# EAGLE design powermeter (EAGLE 6.6.0)
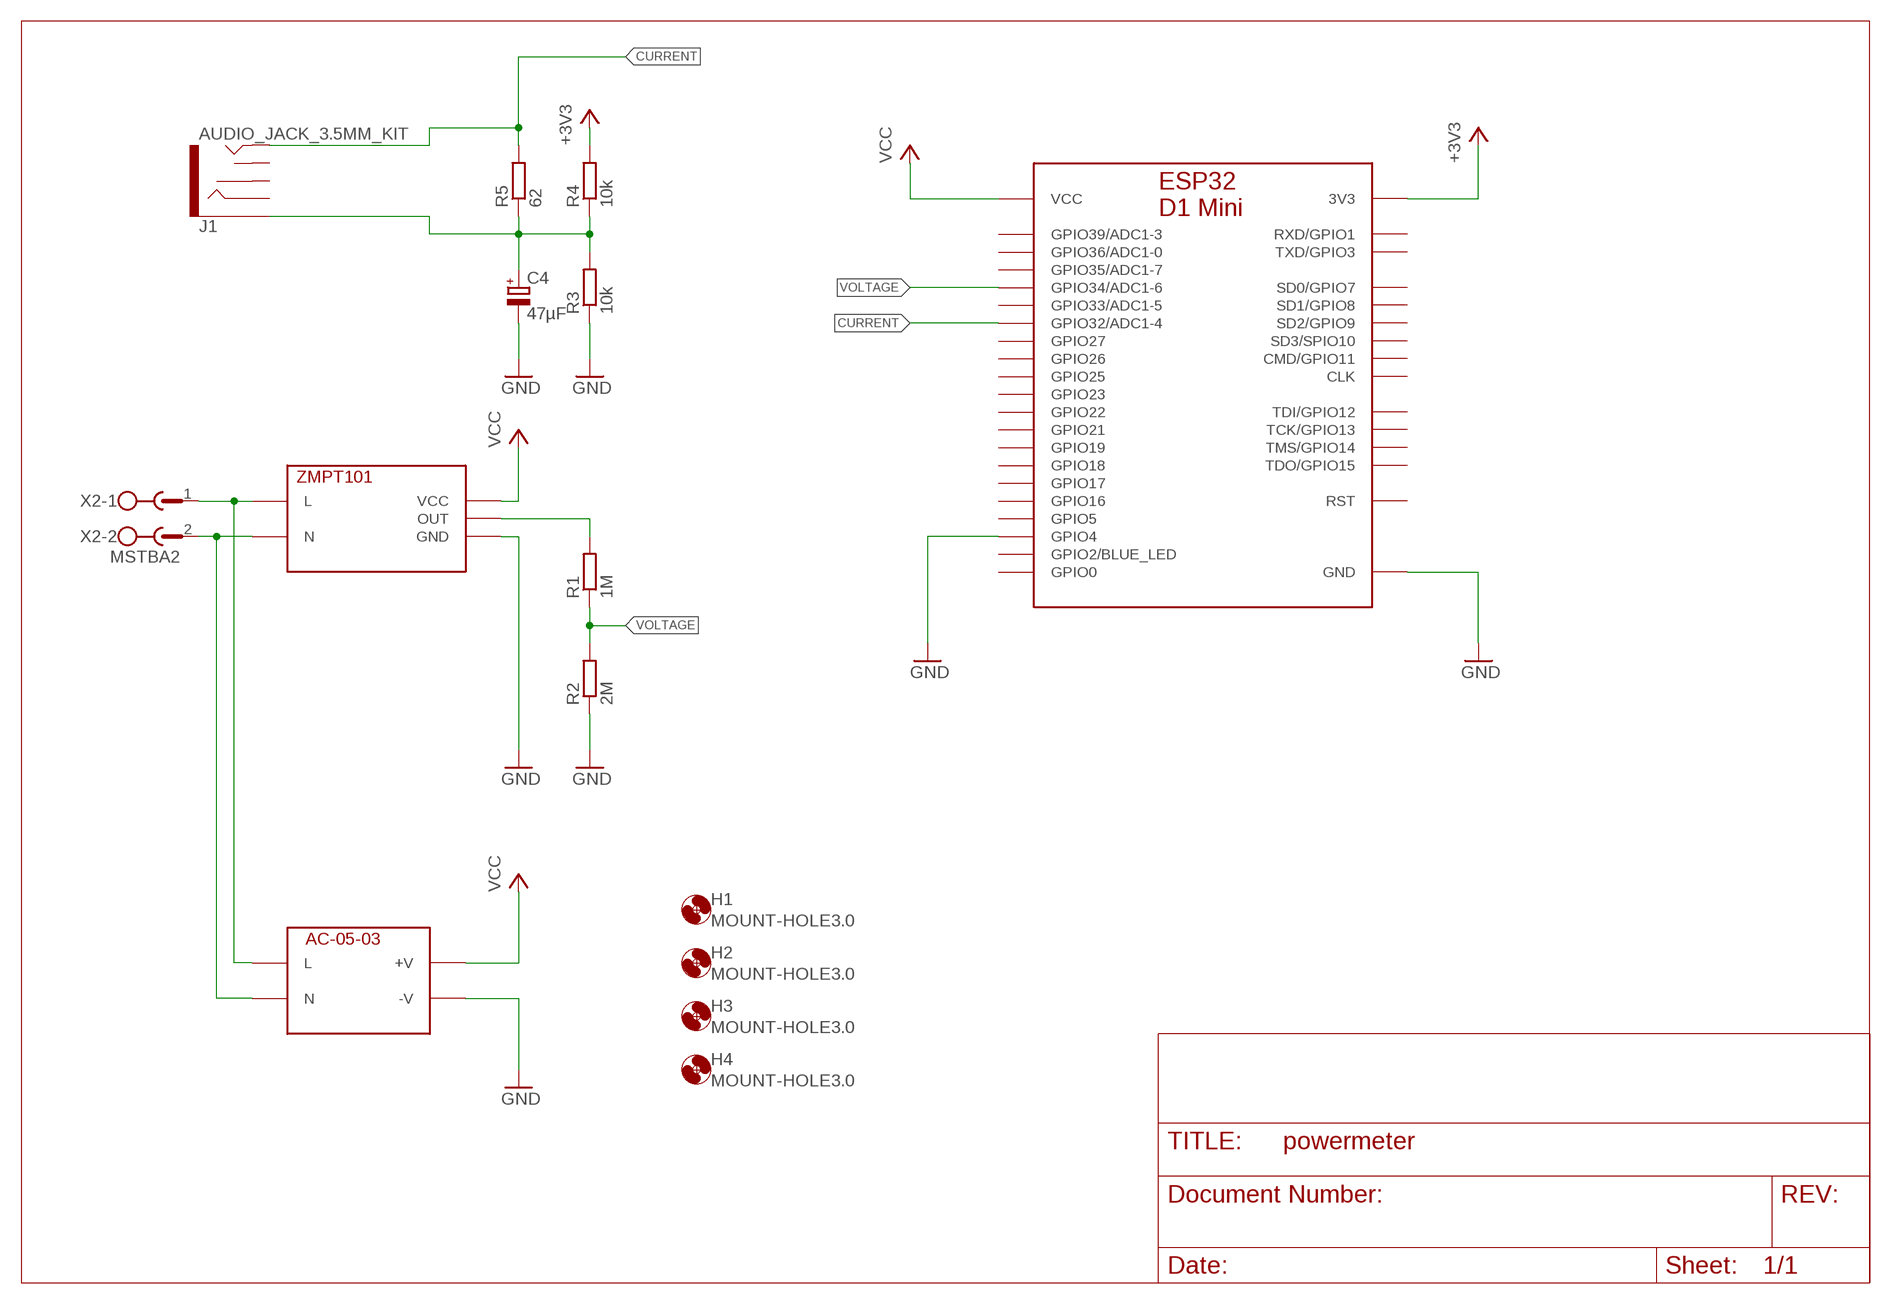
[diagram p0: schematic, sheet 1]

## Parts
C4  47µF  CPOL-EUE2.5-5  [E2,5-5]
H1  MOUNT-HOLE3.0  [3,0]
H2  MOUNT-HOLE3.0  [3,0]
H3  MOUNT-HOLE3.0  [3,0]
H4  MOUNT-HOLE3.0  [3,0]
J1  AUDIO_JACK_3.5MM_KIT  [AUDIO-JACK-KIT]
R1  1M  R-EU_0204/7  [0204/7]
R2  2M  R-EU_0204/7  [0204/7]
R3  10k  R-EU_0204/7  [0204/7]
R4  10k  R-EU_0204/7  [0204/7]
R5  62  R-EU_0204/7  [0204/7]
U1  ESP32D1MINI  [ESP32D1MINI]
U$1  ZMPT101  [ZMPT101]
U$2  AC-05-03  [AC-05-03]
X2  MSTBA2  [MSTBA2]

## Nets
+3V3: R4.2 U1.3V3
CURRENT: J1.TIP R5.2 U1.IO32(GPIO32/ADC1-4)
GND [power]: C4.- R2.1 R3.1 U1.GND1(GND) U1.GND2(GND) U1.GND3(GND) U1.IO4(GPIO4) U$1.P$3(GND) U$1.P$4(GND) U$2.-V
N$1: R1.2 U$1.OUT
N$2 [230v]: U$1.L U$2.L X2.1
N$3: C4.+ J1.SLEEVE R3.2 R4.1 R5.1
N$4 [230v]: U$1.N U$2.N X2.2
VCC [power]: U1.VCC U$1.VCC U$2.+V
VOLTAGE: R1.1 R2.2 U1.IO34(GPIO34/ADC1-6)
Unconnected: J1.RING J1.RSH J1.TSH U1.CLK U1.CMD(CMD/GPIO11) U1.IO0(GPIO0) U1.IO2(GPIO2/BLUE_LED) U1.IO5(GPIO5) U1.IO16(GPIO16) U1.IO17(GPIO17) U1.IO18(GPIO18) U1.IO19(GPIO19) U1.IO21(GPIO21) U1.IO22(GPIO22) U1.IO23(GPIO23) U1.IO25(GPIO25) U1.IO26(GPIO26) U1.IO27(GPIO27) U1.IO33(GPIO33/ADC1-5) U1.IO35(GPIO35/ADC1-7) U1.IO36(GPIO36/ADC1-0) U1.IO39(GPIO39/ADC1-3) U1.RST U1.RXD(RXD/GPIO1) U1.SD0(SD0/GPIO7) U1.SD1(SD1/GPIO8) U1.SD2(SD2/GPIO9) U1.SD3(SD3/SPIO10) U1.TCK(TCK/GPIO13) U1.TDI(TDI/GPIO12) U1.TDO(TDO/GPIO15) U1.TMS(TMS/GPIO14) U1.TXD(TXD/GPIO3)

## Library data of the parts
C4 = rcl:CPOL-EU: POLARIZED CAPACITOR, European symbol
H1-H4 = holes:MOUNT-HOLE: MOUNTING HOLE with drill center marker
J1 = SparkFun-Connectors:AUDIO_JACK_3.5MM: Audio Jack 3.5mm variants of PTH and SMT stereo audio jack with bypass switches. SparkFun Products: SparkFun SparkPunk Sound Kit <[https://www.sparkfun.com/products/11177]> - PTH MP3 Trigger <https://www.sparkfun.com/products/13720> -3.5mm SMD SparkFun PicoBoard <https://www.sparkfun.com/products/11888>- 2.5mm SMD; PROD_ID: CONN-08774; SF_ID: PRT-08032
R1-R5 = rcl:R-EU_: RESISTOR, European symbol
U1 = esp32-d1-mini:ESP32D1MINI
U$1 = ZMPT101:ZMPT101
U$2 = AC-05-03:AC-05-03
X2 = con-phoenix-508:MSTBA2: PHOENIX; MF: FARNELL; MPN: 1757242; OC_FARNELL: 3705171; OC_NEWARK: 71C4161

## Net classes
0 default: width 0.305 mm, clearance 0.159 mm
1 power: width 0.61 mm, clearance 0.159 mm
2 230v: width 1.422 mm, clearance 1.676 mm

## Board
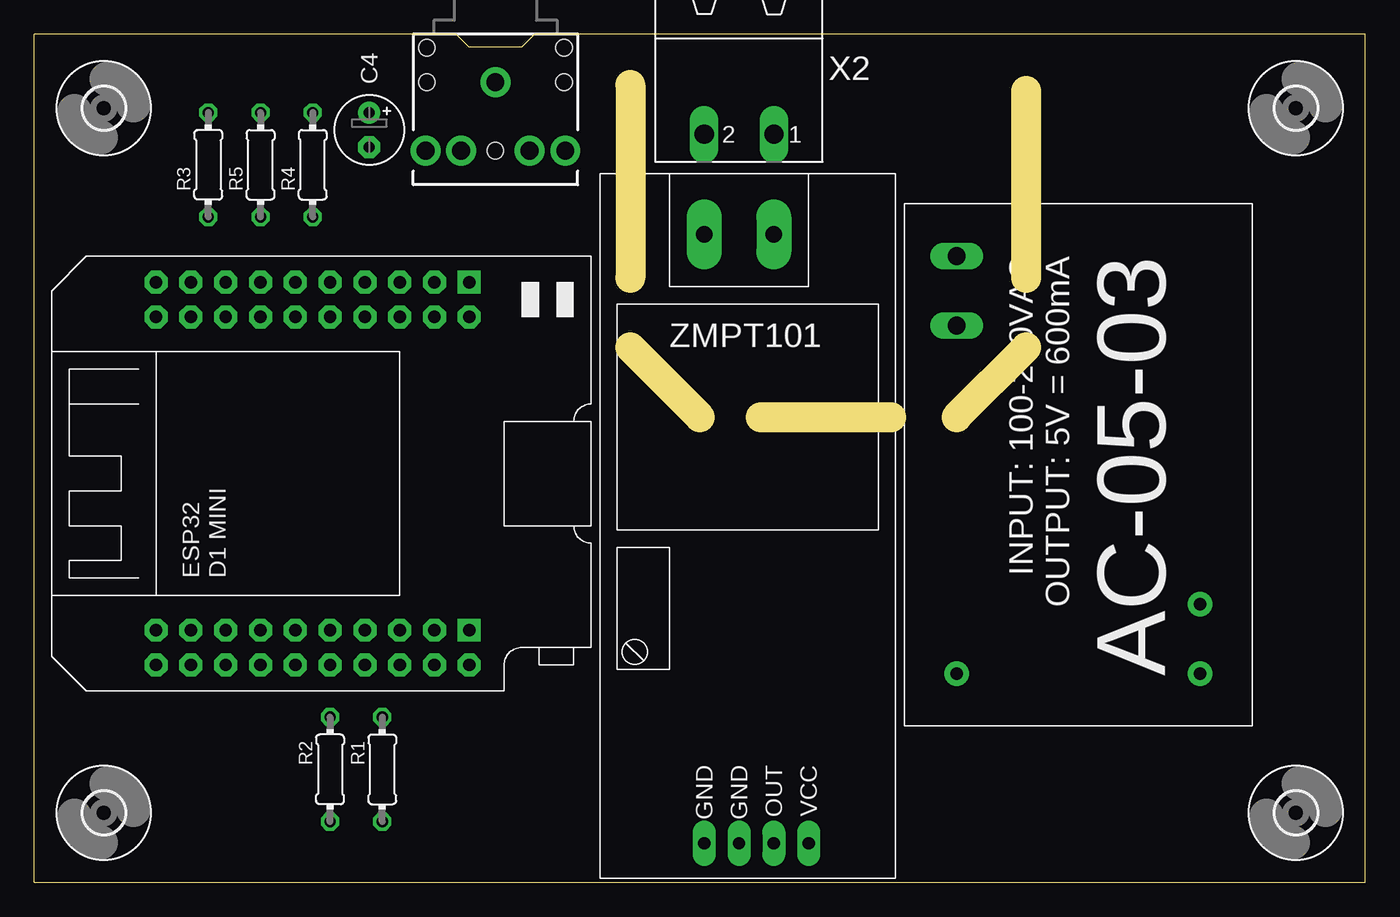
[diagram p1: board, top side]
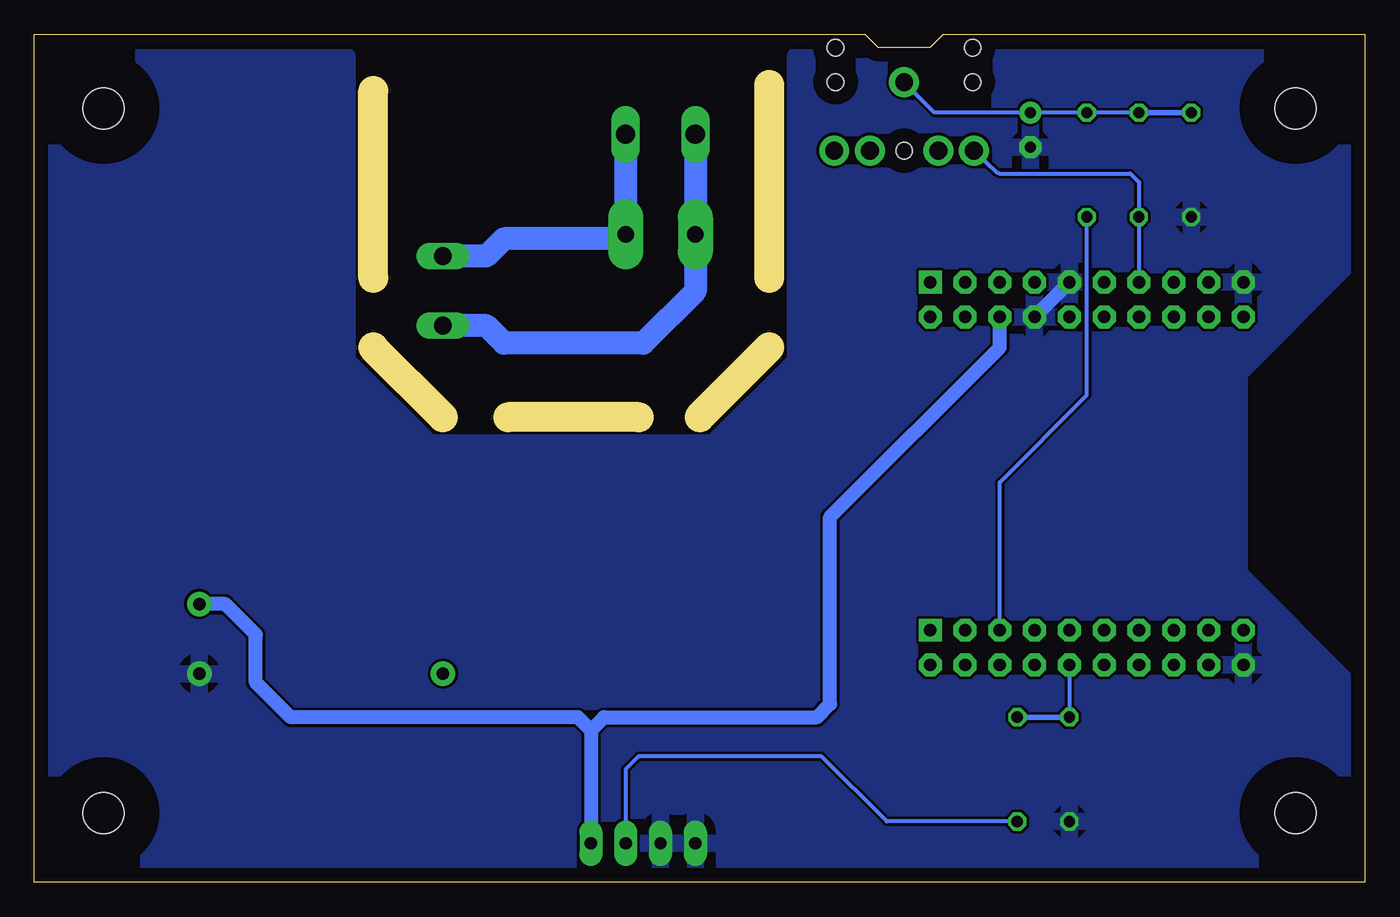
[diagram p2: board, bottom side, seen from below]

Size 97.14 x 61.91 mm. Coordinates in mm from the lower left corner, seen from the top.
Outline: 0,0 97.14,0 97.14,61.9 38.42,61.91 36.51,61.91 35.56,60.96 31.75,60.96 30.8,61.91 0.32,61.91 0,61.9 0,0
Copper layers (1*16): Top 0.035mm / dielectric 1.5mm / Bottom 0.035mm
Design rules "default *": minimum track width 10mil, minimum drill 24mil, track to track 8mil, track to pad 8mil, pad to pad 8mil, via to via 8mil, smd to smd 8mil, copper to edge 40mil, drill to drill 8mil, minimum pad ring 10mil, minimum via ring 8mil, stop-mask expansion 4mil, vias tented up to drill 0mil, thermal gap 25mil
Milling: 5 lines

### Footprints (pad centres in the part's own frame; a part is rotated, then mirrored left to right if it is on the bottom)
E2,5-5 = drill 0.813 pad 1.6: + -1.27,0 | drill 0.813 pad 1.6 octagon: - 1.27,0
3,0 = hole 3: 0,0
AUDIO-JACK-KIT = drill 1.3 pad 2.184: RING 5,5.1; RSH 5,2.5; SLEEVE 0,0; TIP 5,-5.1; TSH 5,-2.5 | hole 1.2: 0,5; -2.5,5; -2.5,-5; 0,-5; 5,0
0204/7 = drill 0.813 octagon: 1 -3.81,0; 2 3.81,0
ESP32D1MINI = drill 0.9 pad 1.676 octagon: 3V3 -11.43,-6.35; CMD -13.97,-11.43; GND1 11.43,-3.81; GND2 13.97,11.43; GND3 -13.97,11.43; IO0 13.97,-3.81; IO2 13.97,-6.35; IO4 13.97,-1.27; IO5 -11.43,-3.81; IO16 11.43,-1.27; IO17 11.43,1.27; IO18 -11.43,3.81; IO19 -11.43,1.27; IO21 11.43,3.81; IO22 11.43,6.35; IO23 -11.43,-1.27; IO25 13.97,6.35; IO26 -11.43,6.35; IO27 13.97,8.89; IO32 13.97,3.81; IO33 -13.97,1.27; IO34 -13.97,-1.27; IO35 -13.97,3.81; IO36 -11.43,8.89; IO39 -13.97,6.35; NC -13.97,8.89; P$13 -13.97,-6.35; RST -11.43,11.43; RXD 11.43,8.89; SD0 11.43,-11.43; SD1 13.97,-8.89; SD2 -13.97,-8.89; TCK -11.43,-8.89; TDI 13.97,1.27; TDO 11.43,-8.89; TMS -13.97,-3.81; TXD 11.43,11.43; VCC 11.43,-6.35 | drill 0.9 pad 1.676 square: CLK 13.97,-11.43; SD3 -11.43,-11.43
ZMPT101 = drill 1.2 pad 2.54 long: L -22.86,2.54; N -22.86,-2.54 | drill 0.9 pad 1.676 long: OUT 21.59,2.54; P$3 21.59,0; P$4 21.59,-2.54; VCC 21.59,5.08
AC-05-03 = drill 0.9 pad 1.778: +V 10.16,8.89; -V 15.24,8.89; NC 15.24,-8.89 | drill 1.3 long: L -15.24,-8.89; N -10.16,-8.89
MSTBA2 = drill 1.397 long: 1 -2.54,5.08; 2 2.54,5.08

### Placement (x,y rotation side)
C4  24.45,54.93 270 top
H1  92.08,56.52 0 top
H2  92.08,5.08 0 top
H3  5.08,5.08 0 top
H4  5.08,56.52 0 top
J1  33.66,58.42 270 top
R1  25.4,8.26 270 top
R2  21.59,8.26 90 top
R3  12.7,52.39 90 top
R4  20.32,52.39 270 top
R5  16.51,52.39 270 top
U1  20.32,29.84 90 top
U$1  51.44,24.45 270 top
U$2  76.2,30.48 270 top
X2  51.44,59.69 180 top

### Tracks (layer width: path | path; a pad name or v marks a point on that pad's centre or on a via)
+3V3
  Bottom 0.305: U1.3V3 26.67,29.21 20.32,35.56 R4.2
CURRENT
  Bottom 0.305: J1.TIP 26.91,51.83 26.67,51.75 17.14,51.75 16.51,51.12 R5.2 U1.IO32
GND
  Bottom 0.61: U$2.-V | U$2.-V 84.77,15.56 85.09,15.56
  Bottom 1.016: U1.IO4 U1.GND1
  pour Bottom: 1.27,60.33 41.59,60.33 41.59,38.1 47.62,32.07 68.26,32.07 74.3,38.1 74.3,60.33 95.89,60.33 95.89,1.27 1.27,1.27 1.27,14.61 9.21,22.54 9.21,37.15 1.27,45.09
N$1
  Bottom 0.305: R1.2 34.92,4.45 39.69,9.21 53.02,9.21 53.98,8.26 U$1.OUT
N$2
  Bottom 1.676: U$1.L X2.1 53.98,46.99 62.87,46.99 64.14,45.72 U$2.L
N$3
  Bottom 0.305: R5.1 R4.1 C4.+ 31.43,56.2 J1.SLEEVE
  Bottom 0.406: R3.2 R5.1
N$4
  Bottom 1.676: X2.2 U$1.N 48.9,43.18 52.7,39.37 62.87,39.37 64.14,40.64 U$2.N
VCC
  Bottom 1.016: 56.52,11.11 57.47,12.06 78.42,12.06 80.96,14.61 80.96,18.1 83.19,20.32 U$2.+V | 56.52,11.11 55.56,12.06 40.01,12.06 39.05,13.02 39.05,26.67 26.67,39.05 U1.VCC | 56.52,11.11 U$1.VCC
VOLTAGE
  Bottom 0.305: U1.IO34 R2.2
  Bottom 0.406: R1.1 R2.2